# EAGLE design arduinoVisor2 (EAGLE 9.5.2)

## Sheet 1 of 2
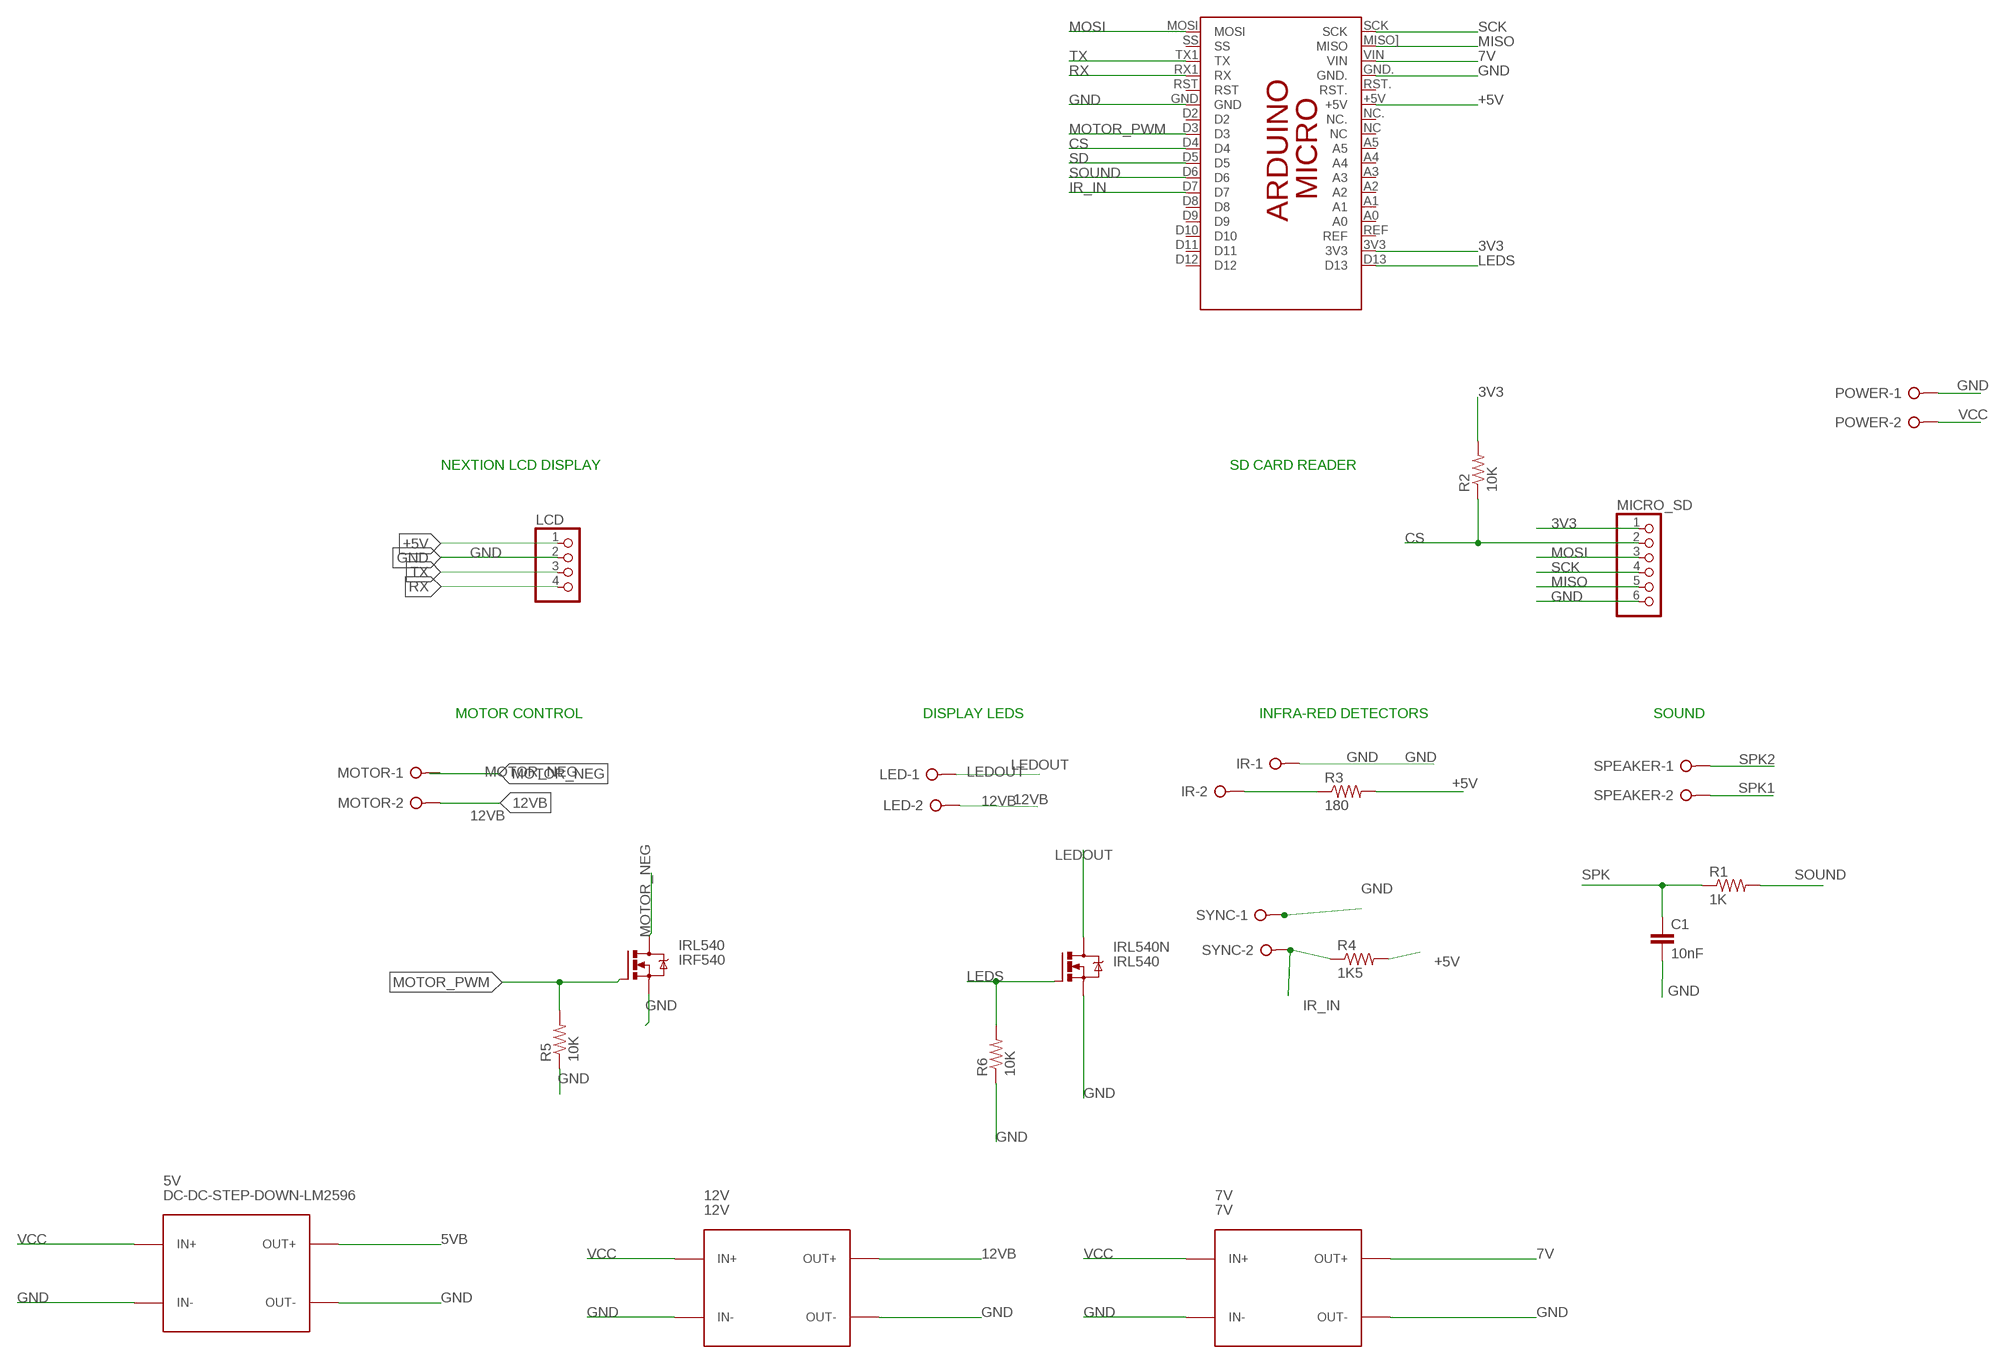
[diagram p0: schematic, sheet 1]

### Parts
5V  DC-DC-STEP-DOWN-LM2596  [DC-DC-STEP-DOWN-LM2596]
7V  7V  DC-DC-STEP-DOWN-LM2596  [DC-DC-STEP-DOWN-LM2596]
12V  12V  DC-DC-STEP-DOWN-LM2596  [DC-DC-STEP-DOWN-LM2596]
C1  10nF  C2.5/2  [C2.5-2]
IR  W237-02P  [W237-132]
IRL540  IRF540  [TO220BV]
IRL540N  IRL540  IRF540  [TO220BV]
LCD  PINHD-1X4  [1X04]
LED  W237-02P  [W237-132]
MICRO_SD  PINHD-1X6  [1X06]
MOTOR  W237-02P  [W237-132]
PCB2  ARDUINO_MICRO  [ARDUINO_MICRO]
POWER  W237-02P  [W237-132]
R1  1K  R-US_0207/10  [0207/10]
R2  10K  R-US_0207/10  [0207/10]
R3  180  R-US_0207/10  [0207/10]
R4  1K5  R-US_0207/10  [0207/10]
R5  10K  R-US_0207/10  [0207/10]
R6  10K  R-US_0207/10  [0207/10]
SPEAKER  W237-02P  [W237-132]
SYNC  W237-02P  [W237-132]

### Nets
3V3: MICRO_SD.1 PCB2.3V3 R2.2
5VB: 5V.OUT+ ; also sheet 2
7V: 7V.OUT+ PCB2.VIN
12VB: 12V.OUT+ LED.2 MOTOR.2
+5V: LCD.1 PCB2.+5V R3.2 R4.2
CS: MICRO_SD.2 PCB2.D4 R2.1
GND: 5V.IN- 5V.OUT- 7V.IN- 7V.OUT- 12V.IN- 12V.OUT- C1.2 IR.1 IRL540.S IRL540N.S LCD.2 MICRO_SD.6 PCB2.GND PCB2.GND. POWER.1 R5.1 R6.1 SYNC.1 ; also sheet 2
IR_IN: PCB2.D7 R4.1 SYNC.2
IR_OUT: IR.2 R3.1
LEDOUT: IRL540N.D LED.1
LEDS: IRL540N.G PCB2.D13 R6.2
MISO: MICRO_SD.5 PCB2.MISO](MISO)
MOSI: MICRO_SD.3 PCB2.MOSI
MOTOR_NEG: IRL540.D MOTOR.1
MOTOR_PWM: IRL540.G PCB2.D3 R5.2
RX: LCD.4 PCB2.RX1(RX)
SCK: MICRO_SD.4 PCB2.SCK
SD: PCB2.D5 ; also sheet 2
SOUND: PCB2.D6 R1.2
SPK: C1.1 R1.1 ; also sheet 2
SPK1: SPEAKER.2 ; also sheet 2
SPK2: SPEAKER.1 ; also sheet 2
TX: LCD.3 PCB2.TX1(TX)
VCC: 5V.IN+ 7V.IN+ 12V.IN+ POWER.2
Unconnected: PCB2.A0 PCB2.A1 PCB2.A2 PCB2.A3 PCB2.A4 PCB2.A5 PCB2.D2 PCB2.D8 PCB2.D9 PCB2.D10 PCB2.D11 PCB2.D12 PCB2.NC PCB2.NC. PCB2.REF PCB2.RST PCB2.RST. PCB2.SS

### Notes on the sheet
- NEXTION LCD DISPLAY | SD CARD READER
- MOTOR CONTROL | DISPLAY LEDS | INFRA-RED DETECTORS | SOUND

## Sheet 2 of 2
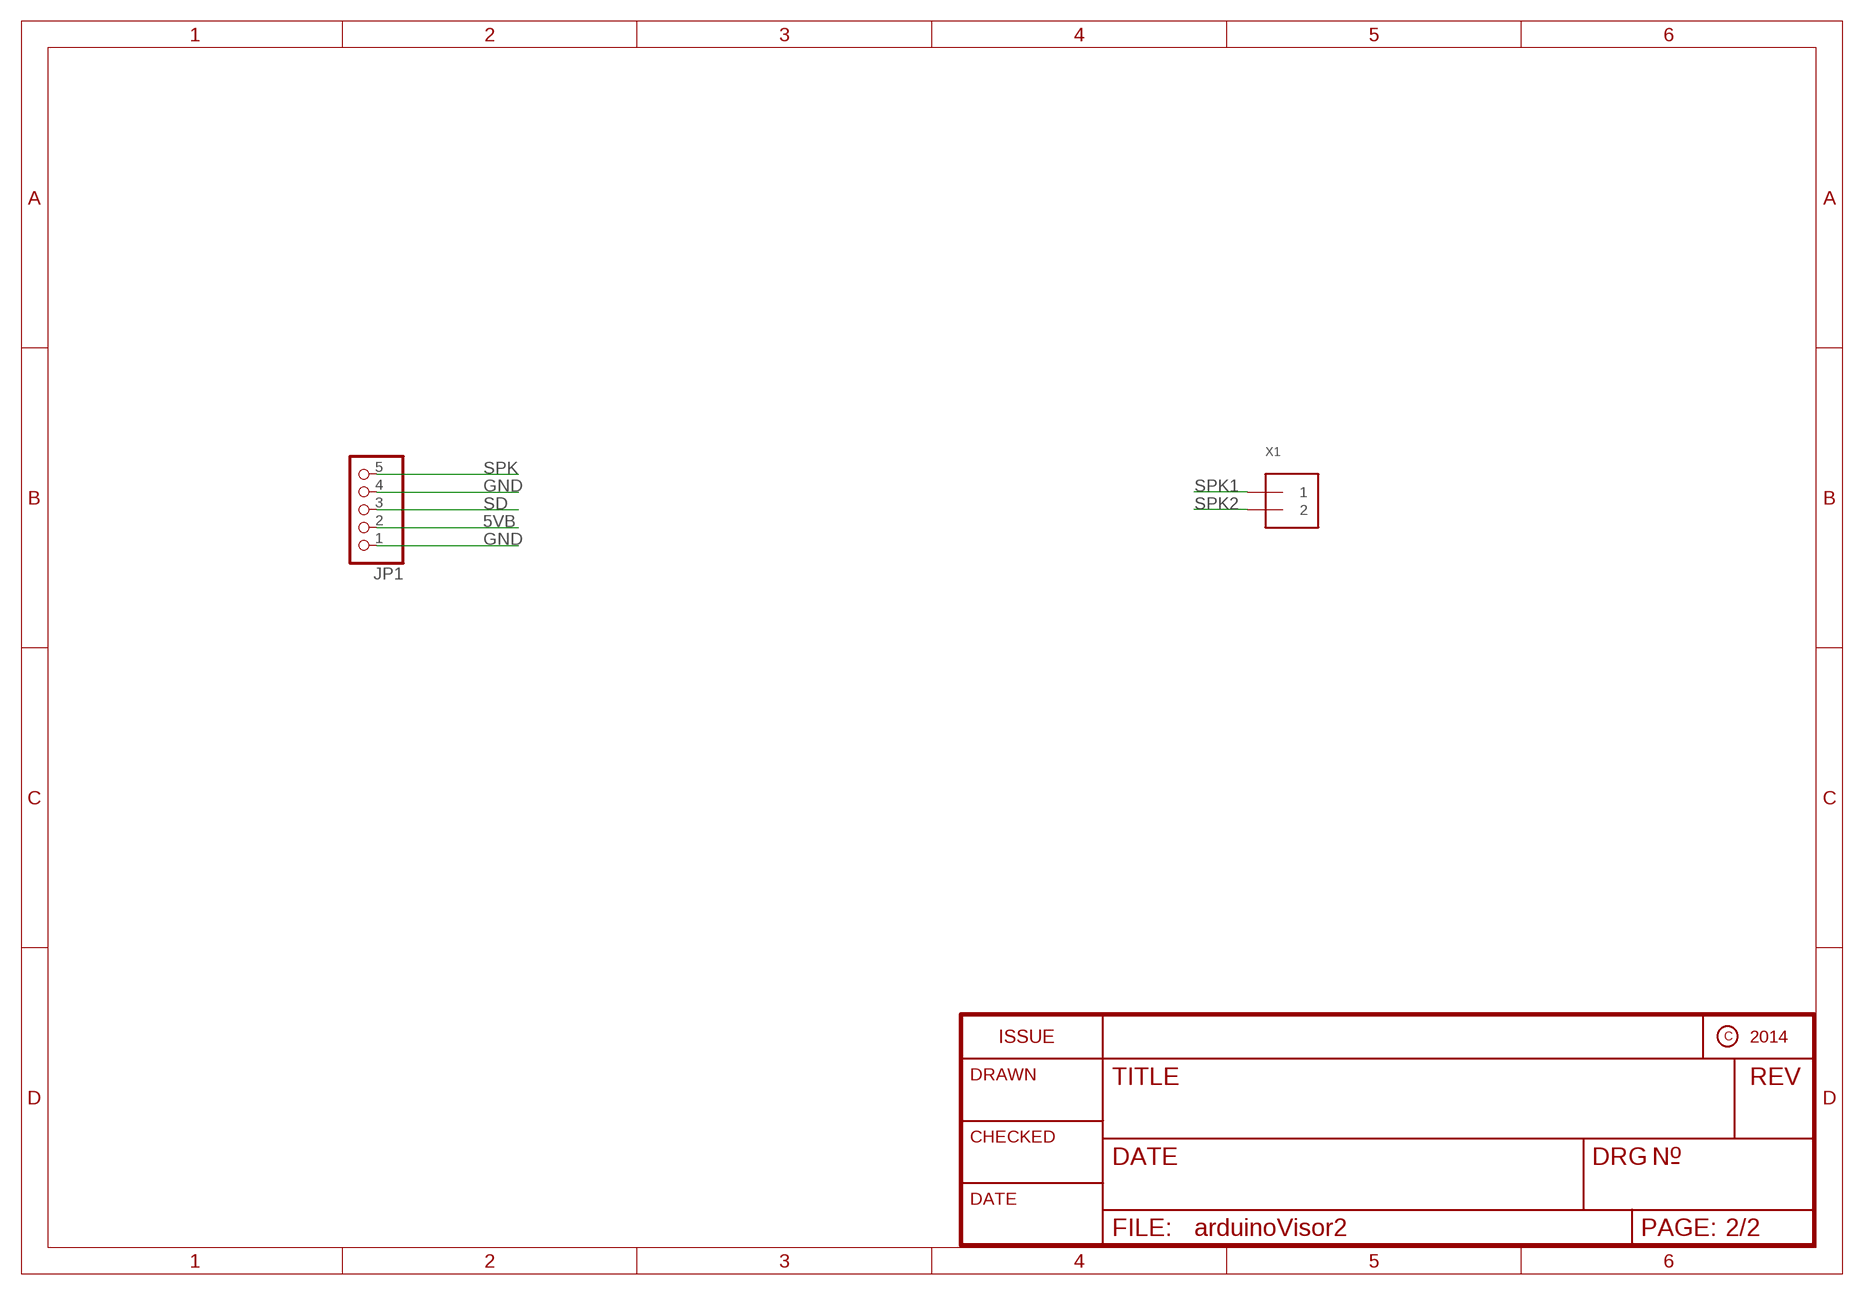
[diagram p1: schematic, sheet 2]

### Parts
JP1  HEADER-1X570MIL  [1X05_ROUND_70]
X1  TERMBLOCK_1X2  [TERMBLOCK_1X2-3.5MM]

### Nets
5VB: JP1.2 ; also sheet 1
GND: JP1.1 JP1.4 ; also sheet 1
SD: JP1.3 ; also sheet 1
SPK: JP1.5 ; also sheet 1
SPK1: X1.1 ; also sheet 1
SPK2: X1.2 ; also sheet 1

## Library data of the parts
5V 7V 12V = diy-modules boo:DC-DC-STEP-DOWN-LM2596: DC/DC Step-Down Regulator based on LM2596-ADJ chip LM2596 datasheet available here: http://www.ti.com/lit/ds/symlink/lm2596.pdf Click here to find device on ebay.com <http://www.ebay.com/sch/lm2596+power+regulator>
C1 = capacitor-wima:C: CAPACITOR naming: grid - package width
IR LED MOTOR POWER SPEAKER SYNC = con-wago-508:W237-02P: WAGO SREW CLAMP; OC_FARNELL: unknown; OC_NEWARK: unknown
IRL540 IRL540N = transistor-power:IRF540: HEXFET Power MOSFET
JP1 = microbuilder:HEADER-1X5: PIN HEADER
LCD = pinhead:PINHD-1X4: PIN HEADER
MICRO_SD = pinhead:PINHD-1X6: PIN HEADER
PCB2 = E14_Arduino_revC 2 boo:ARDUINO_MICRO: Device for representing an Arduino Micro board with a footprint in an EAGLE design. Created by Dave Young for Element14. More EAGLE documentation at: http://www.element14.com/community/community/knode/cadsoft_eagle
R1-R6 = rcl:R-US_: RESISTOR, American symbol
X1 = microbuilder:TERMBLOCK_1X2: 3.5mm Terminal block http://www.ladyada.net/library/pcb/eaglelibrary.html

## Board
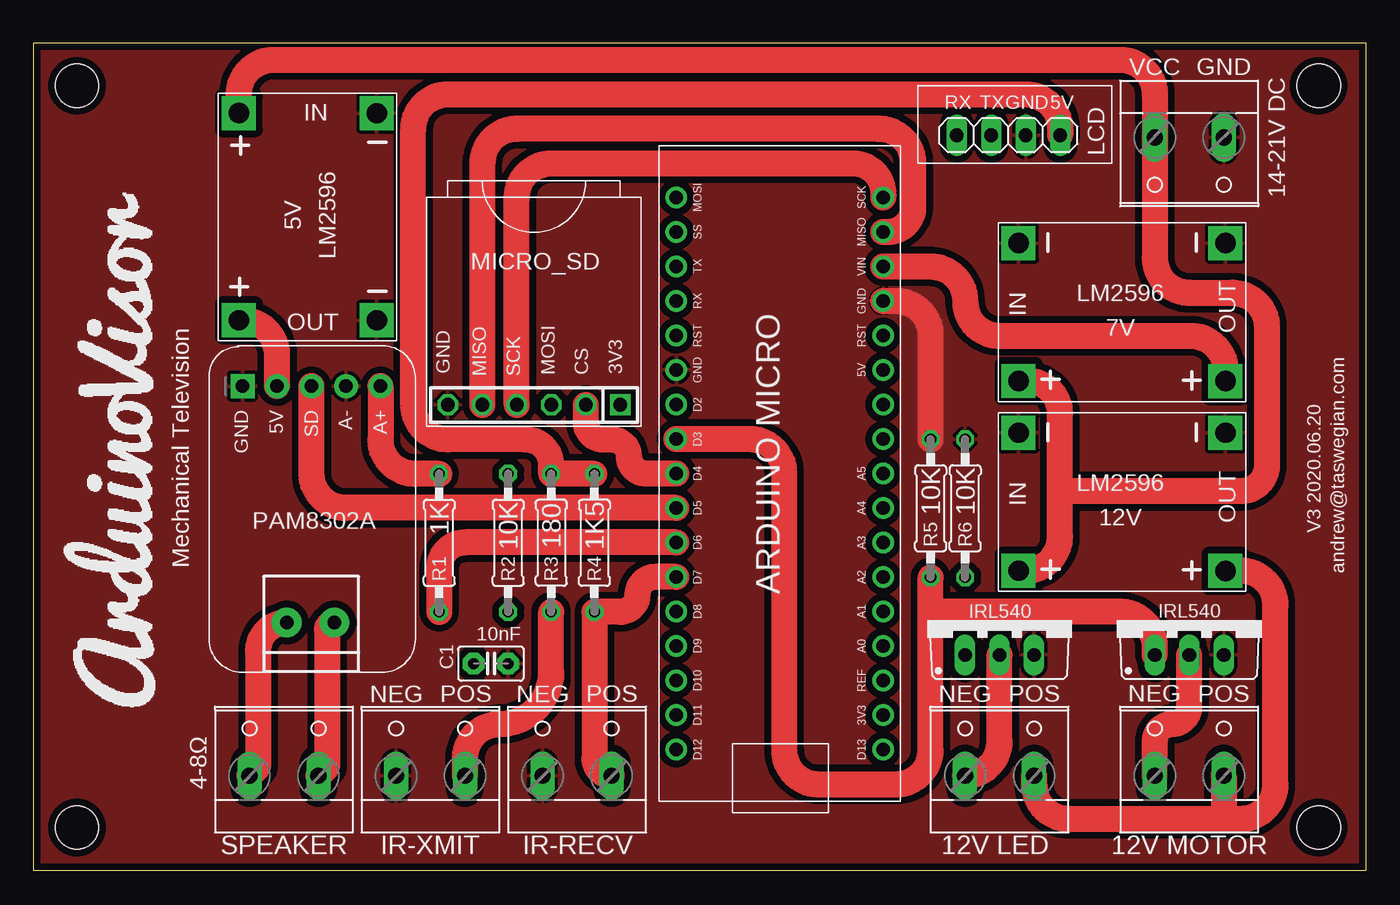
[diagram p2: board, top side]
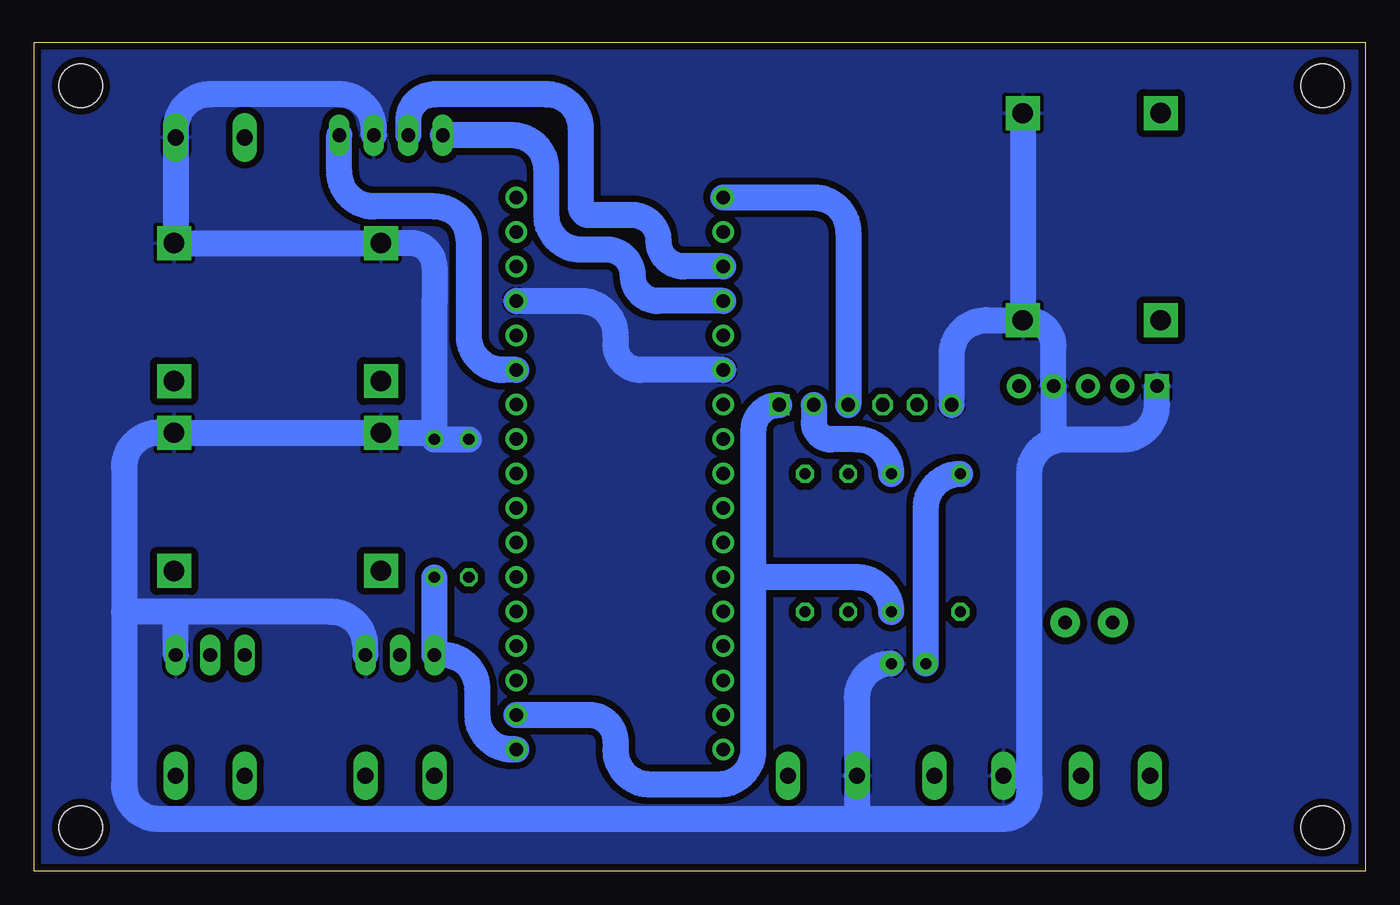
[diagram p3: board, bottom side, seen from below]

Size 98.07 x 60.96 mm. Coordinates in mm from the lower left corner, seen from the top.
Outline: 0,60.96 98.07,60.96 98.07,0 0,0 0,60.96
Copper layers (1*16): Top 0.035mm / dielectric 1.5mm / Bottom 0.035mm
Design rules "SeeedStudio_2layer_DRU_no_angle_20140221": minimum track width 6mil, minimum drill 12mil, track to track 6mil, track to pad 6mil, pad to pad 6mil, via to via 6mil, smd to smd 0mil, copper to edge 10mil, drill to drill 10mil, minimum pad ring 10mil, minimum via ring 6mil, stop-mask expansion 2mil, vias tented up to drill 100mil, thermal gap 10mil
Holes 3.2 mm at 3.17,57.78 94.61,57.78 3.17,3.17 94.61,3.17

### Footprints (pad centres in the part's own frame; a part is rotated, then mirrored left to right if it is on the bottom)
DC-DC-STEP-DOWN-LM2596 = drill 1.5 pad 2.5 square: IN+ 1.388,0.485; IN- 1.388,10.641; OUT+ 16.632,0.48; OUT- 16.631,10.641
C2.5-2 = drill 0.813 pad 1.6 octagon: 1 -1.27,0; 2 1.27,0
W237-132 = drill 1.194 long: 1 -2.54,-0.635; 2 2.54,-0.635
TO220BV = drill 1.016 long: D 0,-2.54; G -2.54,-2.54; S 2.54,-2.54
1X05_ROUND_70 = drill 1 pad 1.778 square: 1 -5.08,0 | drill 1 pad 1.778: 2 -2.54,0; 3 0,0; 4 2.54,0; 5 5.08,0
1X04 = drill 1.016 long: 1 -3.81,0; 2 -1.27,0; 3 1.27,0; 4 3.81,0
1X06 = drill 1.016 square: 1 -6.35,0 | drill 1.016 octagon: 2 -3.81,0; 3 -1.27,0; 4 1.27,0; 5 3.81,0; 6 6.35,0
ARDUINO_MICRO = drill 1.016 pad 1.575: 3V3 6.35,1.27; +5V 31.75,1.27; A0 11.43,1.27; A1 13.97,1.27; A2 16.51,1.27; A3 19.05,1.27; A4 21.59,1.27; A5 24.13,1.27; D2 29.21,16.51; D3 26.67,16.51; D4 24.13,16.51; D5 21.59,16.51; D6 19.05,16.51; D7 16.51,16.51; D8 13.97,16.51; D9 11.43,16.51; D10 8.89,16.51; D11 6.35,16.51; D12 3.81,16.51; D13 3.81,1.27; GND 31.75,16.51; GND. 36.83,1.27; MISO] 41.91,1.27; MOSI 44.45,16.51; NC 26.67,1.27; NC. 29.21,1.27; REF 8.89,1.27; RST 34.29,16.51; RST. 34.29,1.27; RX1 36.83,16.51; SCK 44.45,1.27; SS 41.91,16.51; TX1 39.37,16.51; VIN 39.37,1.27
0207/10 = drill 0.813 octagon: 1 -5.08,0; 2 5.08,0
TERMBLOCK_1X2-3.5MM = drill 1 pad 2.184: 1 1.8,0; 2 -1.7,0

### Placement (x,y rotation side)
5V  14.61,57.15 270 top
7V  71.12,35.56 0 top
12V  71.12,21.59 0 top
C1  33.66,15.24 0 top
IR  29.21,7.62 0 top
IRL540  85.09,18.41 0 top
IRL540N  71.12,18.41 0 top
JP1  20.44,35.67 0 top
LCD  71.77,54.14 180 top
LED  71.12,7.62 0 top
MICRO_SD  36.83,34.29 180 top
MOTOR  85.09,7.62 0 top
PCB2  63.82,5.11 90 top
POWER  85.09,53.34 180 top
R1  29.84,24.13 270 top
R2  34.92,24.13 270 top
R3  38.1,24.13 90 top
R4  41.27,24.13 90 top
R5  66.04,26.67 270 top
R6  68.58,26.67 270 top
SPEAKER  18.41,7.62 0 top
SYNC  40.01,7.62 0 top
X1  20.32,18.27 0 top

### Tracks (layer width: path | path; a pad name or v marks a point on that pad's centre or on a via)
3V3
  Bottom 1.905: PCB2.3V3 57.18,11.46 arc90 55.24,9.53 55.24,8.89 arc-90 52.7,6.35 47.62,6.35 arc-90 45.09,8.89 45.09,21.59 | MICRO_SD.1 arc-90 45.09,32.38 45.09,21.59 | R2.2 arc-90 37.47,21.59 45.09,21.59
5VB
  Top 1.905: JP1.2 17.9,37.98 arc90 15.36,40.52 5V.OUT+
7V
  Top 1.905: PCB2.VIN 66.04,44.48 arc-90 68.58,41.94 68.58,41.91 arc90 71.12,39.37 85.21,39.37 arc-90 87.75,36.83 7V.OUT+
12VB
  Top 1.905: LED.2 73.66,6.35 arc90 76.2,3.81 87.63,3.81 | 12V.OUT+ 88.9,22.07 arc-90 91.44,19.53 91.44,6.35 arc-90 88.9,3.81 87.63,3.81 | MOTOR.2 87.63,3.81
+5V
  Top 1.905: LCD.1 75.58,54.61 arc90 73.04,57.15 30.48,57.15 arc90 27.94,54.61 27.94,34.29 arc90 30.48,31.75 36.2,31.75 arc-90 38.1,29.84 R3.2 R4.2
  Bottom 1.905: PCB2.+5V 63.5,36.86 arc90 66.04,39.4 66.04,46.35 arc-90 68.58,48.9 73.04,48.9 arc90 75.58,51.44 LCD.1
CS
  Top 1.905: MICRO_SD.2 40.64,33.02 arc90 41.91,31.75 42.55,31.75 arc-90 43.81,30.48 arc90 45.05,29.24 PCB2.D4
  Bottom 1.905: R2.1 arc-90 37.47,31.75 39.37,31.75 arc90 40.64,33.02 MICRO_SD.2
GND
  Top 1.905: PCB2.GND. 63.5,41.94 arc-90 66.04,39.4 R5.1
  Bottom 1.905: 91.44,19.05 91.44,29.69 arc90 88.9,32.23 12V.OUT- 12V.IN- | 91.44,19.05 91.44,6.35 arc-90 88.9,3.81 37.47,3.81 | 37.47,3.81 SYNC.1 37.47,12.7 arc90 C1.2 | IRL540N.S 73.66,16.51 arc-90 76.2,19.05 87.63,19.05 | 87.63,19.05 91.44,19.05 | IRL540.S 87.63,19.05 | 7V.OUT- 7V.IN- | 7V.IN- arc-90 7V.IN- | 68.58,41.91 68.58,44.45 arc-90 70.33,46.2 7V.IN- | 68.55,41.94 arc-90 68.58,41.91 | PCB2.GND. 57.78,41.94 arc90 55.24,39.4 55.24,38.73 arc-90 53.37,36.86 PCB2.GND | 12V.IN- arc-90 12V.IN- | R6.1 arc-90 68.55,31.78 | 68.55,31.78 68.55,41.94 | 12V.IN- 69,32.23 arc90 68.55,31.78 | 68.55,41.94 arc-90 68.58,41.91 | 37.47,3.81 26.67,3.81 arc-90 24.77,5.71 24.77,6.99 | IR.1 24.77,6.99 | 24.77,6.99 24.77,29.21 arc90 22.23,31.75 | 22.23,31.75 17.9,31.75 arc-90 15.36,34.29 JP1.1 | 22.23,31.75 arc90 22.98,32.51 JP1.4 22.98,38.61 arc-90 24.89,40.52 5V.OUT- 27.94,40.52 arc-90 30.48,37.98 MICRO_SD.6 | 7V.IN- arc-90 7V.IN- | LCD.2 73.04,54.61 arc-90 75.58,57.15 85.09,57.15 arc-90 87.63,54.61 POWER.1
  Bottom 1.93: POWER.1 87.63,46.32 7V.OUT- | R6.1 R5.1 | 5V.IN- 5V.OUT- | 5V.OUT-
  pour Bottom (isolate 0.508): 0,60.96 0,0 98.42,0 98.42,60.96
  pour Top (isolate 0.508): 0,60.96 0,0 97.79,0 97.79,60.96
IR_IN
  Top 1.905: PCB2.D7 45.75,21.62 arc90 44.45,20.32 arc-90 43.18,19.05 R4.1 41.27,8.26 arc90 SYNC.2
IR_OUT
  Top 1.905: IR.2 31.75,8.26 arc-90 34.29,10.79 arc90 38.1,14.61 R3.1
LEDOUT
  Top 1.905: LED.1 arc90 71.12,9.53 IRL540N.D
LEDS
  Bottom 1.905: R6.2 IRL540N.G 67.94,15.88 arc90 65.41,13.34 65.41,11.46 arc-90 62.87,8.92 PCB2.D13
MISO
  Top 1.905: PCB2.MISO] 62.9,47.02 arc90 64.77,48.9 64.77,52.07 arc90 62.23,54.61 35.56,54.61 arc90 33.02,52.07 MICRO_SD.5
MOSI
  Bottom 1.905: PCB2.MOSI 40.64,49.56 arc90 38.1,47.02 MICRO_SD.3
MOTOR_NEG
  Top 1.905: MOTOR.1 82.55,9.53 arc-90 83.82,10.79 arc90 85.09,12.06 IRL540.D
MOTOR_PWM
  Top 1.905: 66.04,19.05 66.04,8.89 arc-90 63.5,6.35 57.78,6.35 arc-90 55.24,8.89 55.24,29.24 arc90 52.7,31.78 PCB2.D3 | 66.04,19.05 R5.2 | IRL540.G 82.55,16.51 arc90 80.01,19.05 66.04,19.05
RX
  Bottom 1.905: PCB2.RX1 52.1,41.94 arc90 53.98,43.81 arc-90 55.88,45.72 57.78,45.72 arc90 60.33,48.26 60.33,51.6 arc-90 62.87,54.14 LCD.4
SCK
  Top 1.905: MICRO_SD.4 35.56,49.53 arc-90 38.1,52.07 60.33,52.07 arc-90 62.55,49.85 PCB2.SCK
SD
  Top 1.905: PCB2.D5 22.98,26.7 arc-90 20.44,29.24 JP1.3
SOUND
  Top 1.905: R1.2 29.84,22.25 arc-90 31.75,24.16 PCB2.D6
SPK
  Top 1.905: JP1.5 25.52,31.75 arc90 28.06,29.21 R1.1
  Bottom 1.905: C1.1 32.38,26.67 arc90 R1.1
SPK1
  Top 1.905: X1.1 arc90 21.59,17.74 21.59,7.62 SPEAKER.2
SPK2
  Top 1.905: SPEAKER.1 16.51,7.62 16.51,16.16 arc-90 X1.2
TX
  Bottom 1.905: PCB2.TX1 50.2,44.48 arc90 52.07,46.35 arc-90 53.98,48.26 57.15,48.26 arc90 57.78,48.9 57.78,54.61 arc-90 60.33,57.15 68.58,57.15 arc-90 70.5,55.23 LCD.3
VCC
  Top 1.905: 12V.IN+ 73.03,22.07 arc90 75.56,24.61 75.56,27.94 | 75.56,27.94 75.56,33.66 arc90 73.17,36.05 7V.IN+ | 5V.IN+ 15.09,57.15 arc-90 17.63,59.69 80.01,59.69 arc-90 82.55,57.15 POWER.2 82.55,45.09 arc90 85.09,42.55 88.27,42.55 arc-90 90.81,40.01 90.81,29.84 arc-90 88.9,27.94 75.56,27.94

### Text on the board
tPlace: VCC | GND | RX | TX | GND | 5V | 14-21V DC | GND | MOSI | CS | 3V3 | MISO | SCK | GND | 5V | SD | A- | A+ | Mechanical Television | V3 2020.06.20 | andrew@taswegian.com | PAM8302A | NEG | POS | NEG | POS | NEG | POS | NEG | POS | 4-8Ω | SPEAKER | IR-XMIT | IR-RECV | 12V LED | 12V MOTOR
tNames: IRL540 | IRL540